# EAGLE design 4301_Conv (EAGLE 9.6.2)
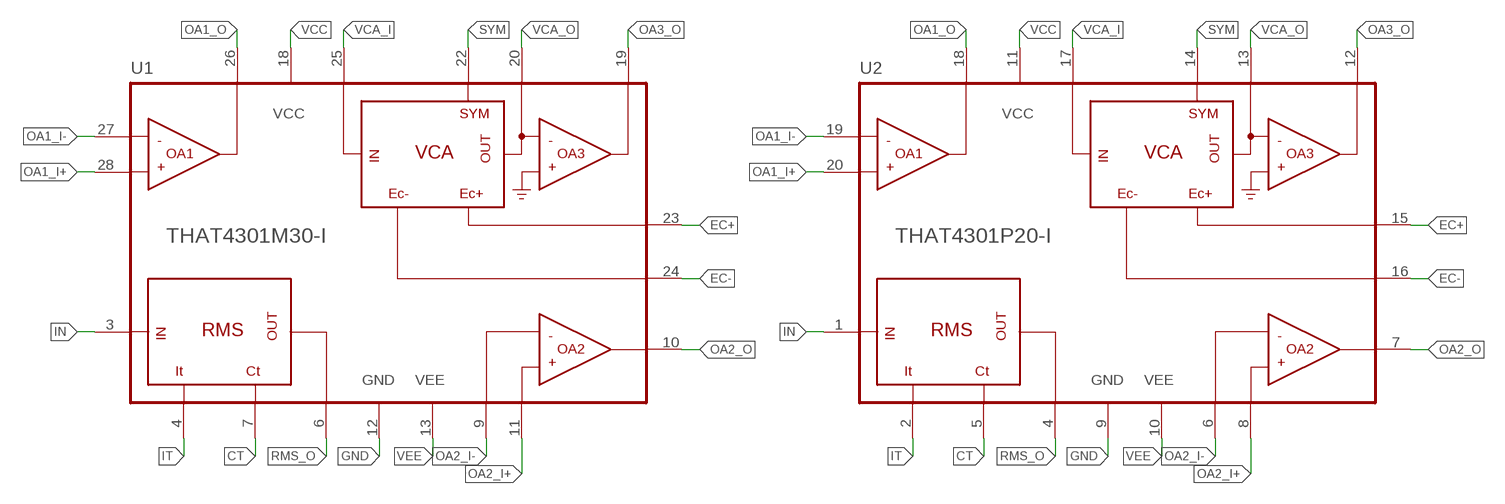
[diagram p0: schematic, sheet 1]

## Parts
U1  THAT4301M30-I  [SO30W]
U2  THAT4301P20-I  [DIL20]

## Nets
CT: U1.7(CT) U2.5(CT)
EC+: U1.23(EC+) U2.15(EC+)
EC-: U1.24(EC-) U2.16(EC-)
GND: U1.12(GND) U2.9(GND)
IN: U1.3(RMS_IN) U2.1(RMS_IN)
IT: U1.4(IT) U2.2(IT)
OA1_I+: U1.28(OA1_+IN) U2.20(OA1_+IN)
OA1_I-: U1.27(OA1_-IN) U2.19(OA1_-IN)
OA1_O: U1.26(OA1_OUT) U2.18(OA1_OUT)
OA2_I+: U1.11(OA2_+IN) U2.8(OA2_+IN)
OA2_I-: U1.9(OA2_-IN) U2.6(OA2_-IN)
OA2_O: U1.10(OA2_OUT) U2.7(OA2_OUT)
OA3_O: U1.19(OA3_OUT) U2.12(OA3_OUT)
RMS_O: U1.6(RMS_OUT) U2.4(RMS_OUT)
SYM: U1.22(SYM) U2.14(SYM)
VCA_I: U1.25(VCA_IN) U2.17(VCA_IN)
VCA_O: U1.20(VCA_OUT) U2.13(VCA_OUT)
VCC: U1.18(VCC) U2.11(VCC)
VEE: U1.13(VEE) U2.10(VEE)

## Library data of the parts
U1 U2 = that-corp:THAT4301: THAT Analog Engine® IC Dynamics Processor

## Board
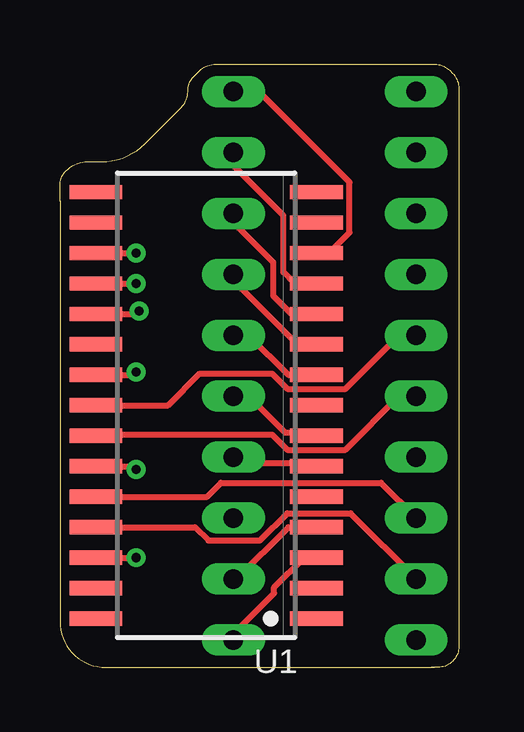
[diagram p1: board, top side]
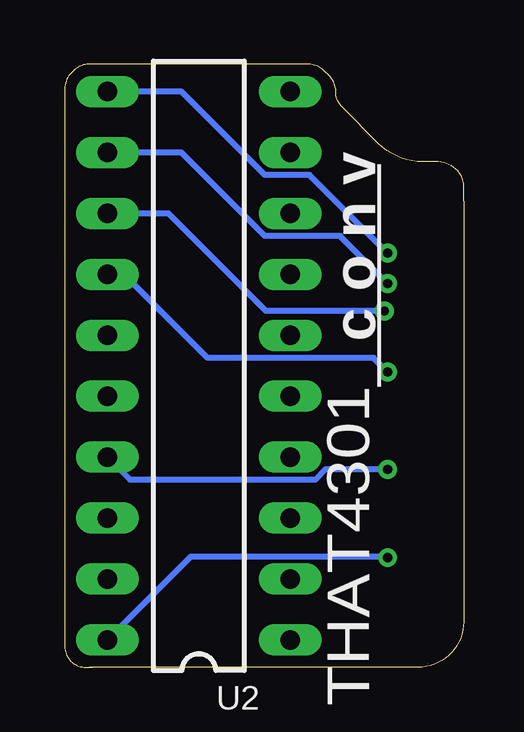
[diagram p2: board, bottom side, seen from below]

Size 16.64 x 25.15 mm. Coordinates in mm from the lower left corner, seen from the top.
Outline: 15.49,0 1.91,0 arc-90 0,1.91 0,19.43 0,20.09 arc-45 0.25,20.7 arc-45 1.17,21.08 1.72,21.08 arc45 3.56,21.84 5.07,23.35 arc45 5.33,24 5.33,24.02 arc-45 5.59,24.64 5.83,24.88 arc-45 6.48,25.15 15.64,25.15 arc-45 16.26,24.89 16.37,24.78 arc-45 16.64,24.13 16.64,0.87 arc-45 16.38,0.25 arc-45 15.77,0 15.49,0
Outline: 15.49,0 15.62,0
Copper layers (1*16): Top 0.035mm / dielectric 1.5mm / Bottom 0.035mm
Design rules "default *": minimum track width 6mil, minimum drill 0.35mm, track to track 6mil, track to pad 6mil, pad to pad 6mil, via to via 6mil, smd to smd 6mil, copper to edge 15mil, drill to drill 6mil, minimum pad ring 10mil, minimum via ring 8mil, stop-mask expansion 4mil, vias tented up to drill 0mil, thermal gap 10mil

### Footprints (pad centres in the part's own frame; a part is rotated, then mirrored left to right if it is on the bottom)
SO30W = smd 0.6 x 2.2: 1 -8.89,-4.6; 2 -7.62,-4.6; 3 -6.35,-4.6; 4 -5.08,-4.6; 5 -3.81,-4.6; 6 -2.54,-4.6; 7 -1.27,-4.6; 8 0,-4.6; 9 1.27,-4.6; 10 2.54,-4.6; 11 3.81,-4.6; 12 5.08,-4.6; 13 6.35,-4.6; 14 7.62,-4.6; 15 8.89,-4.6; 16 8.89,4.6; 17 7.62,4.6; 18 6.35,4.6; 19 5.08,4.6; 20 3.81,4.6; 21 2.54,4.6; 22 1.27,4.6; 23 0,4.6; 24 -1.27,4.6; 25 -2.54,4.6; 26 -3.81,4.6; 27 -5.08,4.6; 28 -6.35,4.6; 29 -7.62,4.6; 30 -8.89,4.6
DIL20 = drill 0.813 long: 1 -11.43,-3.81; 2 -8.89,-3.81; 3 -6.35,-3.81; 4 -3.81,-3.81; 5 -1.27,-3.81; 6 1.27,-3.81; 7 3.81,-3.81; 8 6.35,-3.81; 9 8.89,-3.81; 10 11.43,-3.81; 11 11.43,3.81; 12 8.89,3.81; 13 6.35,3.81; 14 3.81,3.81; 15 1.27,3.81; 16 -1.27,3.81; 17 -3.81,3.81; 18 -6.35,3.81; 19 -8.89,3.81; 20 -11.43,3.81

### Placement (x,y rotation side)
U1  6.1,10.92 90 top
U2  11.05,12.57 90 bottom

### Tracks (layer width: path | path; a pad name or v marks a point on that pad's centre or on a via)
CT
  Top 0.254: U2.5 7.87,11.3 9.4,9.78 10.57,9.78 U1.7
EC+
  Top 0.254: U1.23 4.51,10.92 5.83,12.24 8.85,12.24 9.48,11.61 11.91,11.61 14.14,13.84 U2.15
EC-
  Top 0.254: U1.24 1.55,9.7 8.85,9.7 9.48,9.07 11.91,9.07 14.14,11.3 U2.16
GND
  Top 0.254: U1.12 9.79,16 9.32,16.48 9.32,18.84 7.24,20.91 U2.9
IN
  Top 0.254: U2.1 7.24,1.4 8.94,3.09 8.94,3.34 10.17,4.57 U1.3
IT
  Top 0.254: U2.2 7.37,3.68 9.53,5.84 U1.4
OA1_I+  (via drill 0.38)
  Top 0.254: U1.28 v3.17,4.57
  Bottom 0.254: v3.17,4.57 3.23,4.62 11.38,4.62 U2.20
OA1_I-
  Top 0.254: U1.27 5.63,5.84 6.19,5.28 8.34,5.28 9.48,6.42 12.12,6.42 U2.19
OA1_O
  Top 0.254: U1.26 6.14,7.11 6.72,7.69 13.39,7.69 U2.18
OA2_I+
  Top 0.254: U2.8 7.24,18.54 8.89,16.89 8.89,15.49 9.65,14.73 U1.11
OA2_I-
  Top 0.254: U2.6 7.87,13.84 9.53,12.19 U1.9
OA2_O
  Top 0.254: U1.10 9.91,13.46 7.24,16.13 U2.7
OA3_O  (via drill 0.38)
  Top 0.254: U1.19 v3.17,16
  Bottom 0.254: v3.17,16 5.16,17.98 8.29,17.98 11.77,21.46 U2.12
RMS_O
  Top 0.254: U2.4 8.13,8.76 8.38,8.51 10.57,8.51 U1.6
SYM  (via drill 0.38)
  Top 0.254: U1.22 3.05,12.19 v3.17,12.32
  Bottom 0.254: U2.14 14.48,16 13.78,16 10.68,12.9 3.76,12.9 v3.17,12.32
VCA_I  (via drill 0.38)
  Top 0.254: U1.25 3.05,8.38 v3.17,8.26
  Bottom 0.254: v3.17,8.26 5.76,8.26 6.19,7.82 13.92,7.82 U2.17
VCA_O  (via drill 0.38)
  Top 0.254: U1.20 3.17,14.73 v3.3,14.86
  Bottom 0.254: v3.3,14.86 8.26,14.86 12.32,18.92 U2.13
VCC  (via drill 0.38)
  Top 0.254: U1.18 v3.17,17.27
  Bottom 0.254: v3.17,17.27 6.43,20.52 8.29,20.52 11.77,24 U2.11
VEE
  Top 0.254: U1.13 11.22,17.27 12.07,18.13 12.07,20.23 8.3,24 U2.10

### Text on the board
bPlace: THAT4301______ | c o n v